# EAGLE design BMP280-Breakout_v10 (EAGLE 7.2.0)
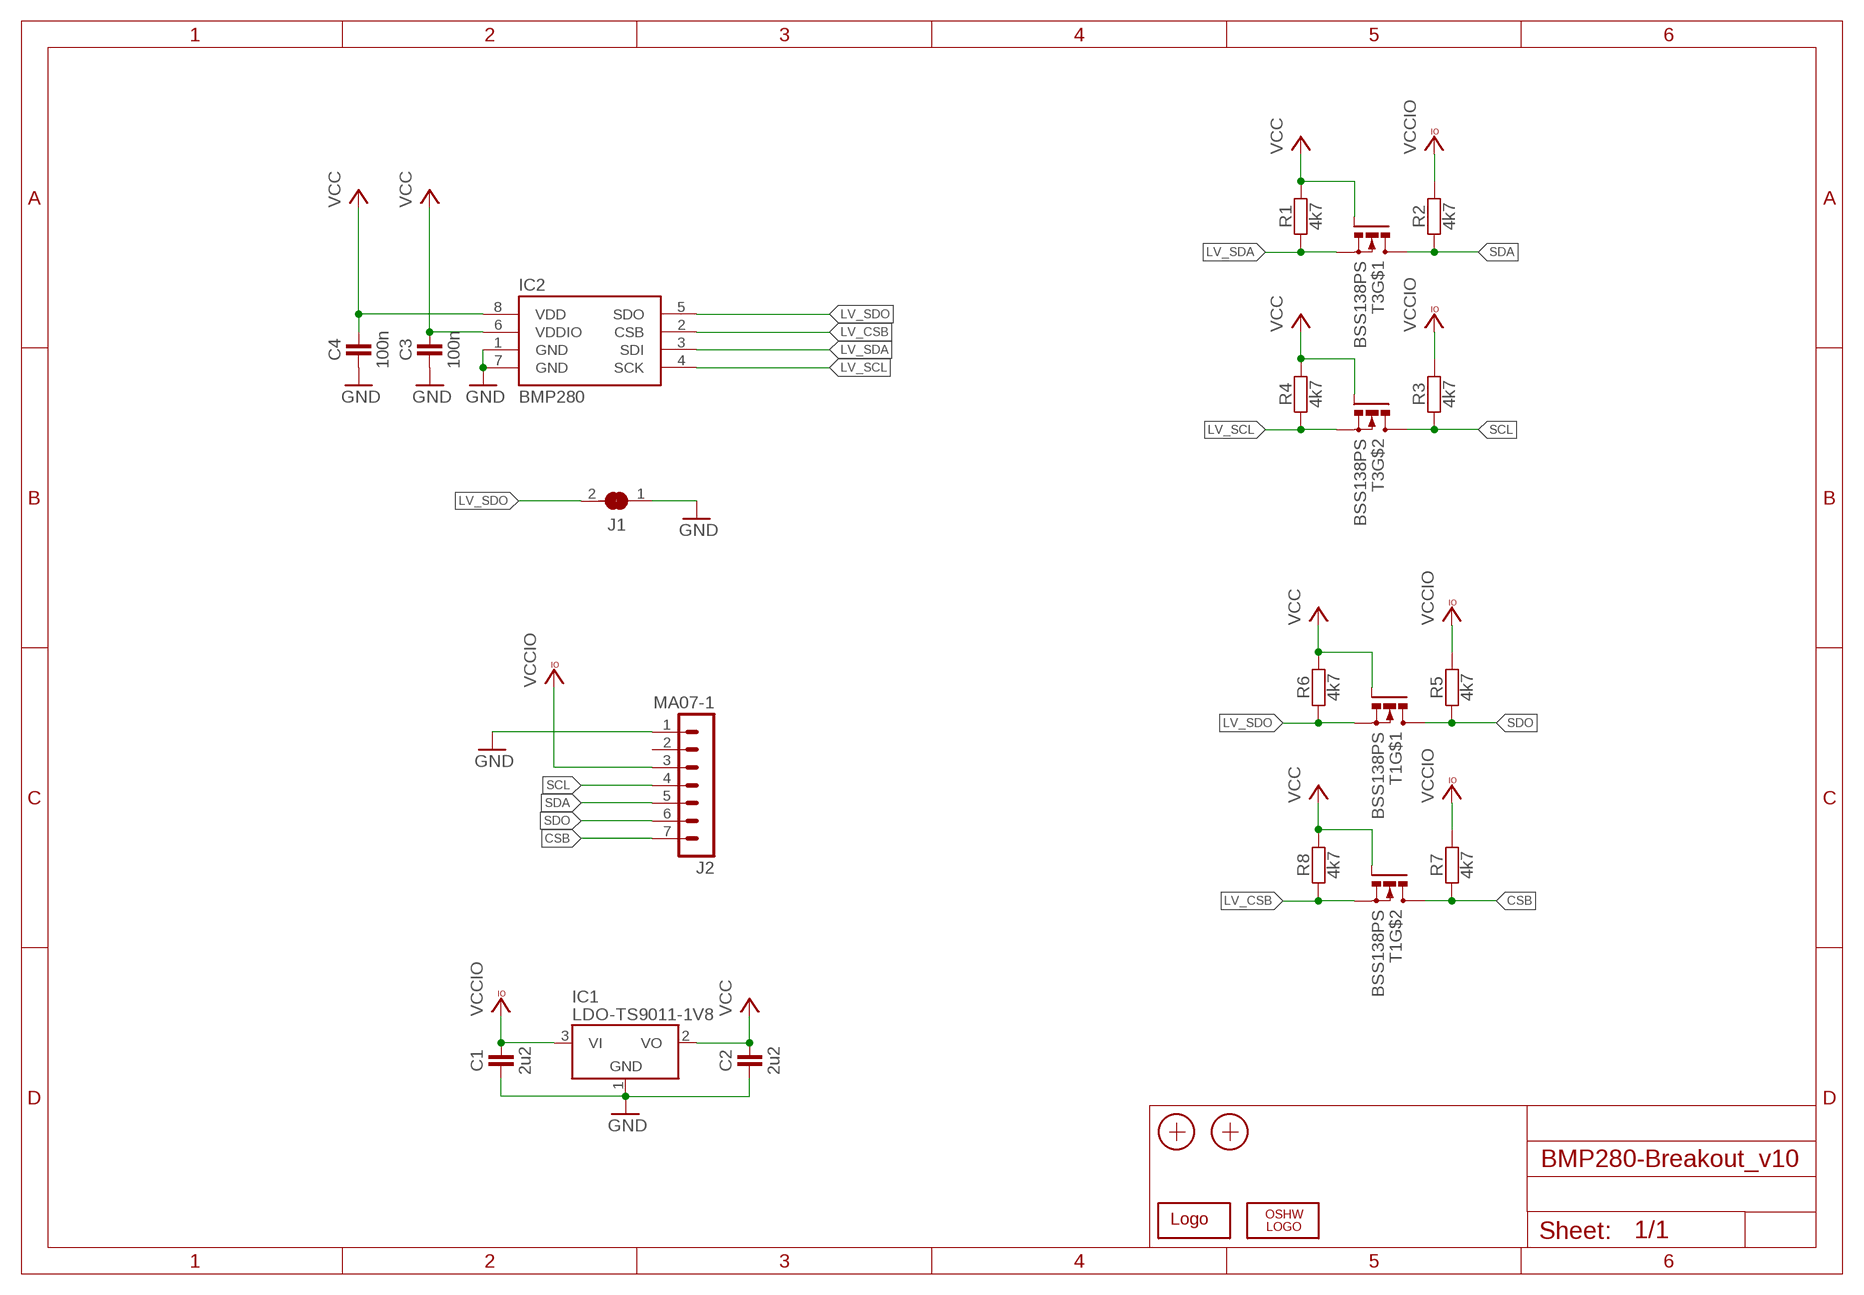
[diagram p0: schematic, sheet 1]

## Parts
C1  2u2  CAPACITOR-C0402  [R0402]
C2  2u2  CAPACITOR-C0402  [R0402]
C3  100n  CAPACITOR-C0402  [R0402]
C4  100n  CAPACITOR-C0402  [R0402]
IC1  LDO-TS9011-1V8  LDO-TS9011-3V3  [SOT23]
IC2  BMP280  [LGA]
J1  JUMPER2  [JUMPER2]
J2  MA07-1  [MA07-1]
LOGO1  LOGO-S_PLACE_M  [SPARK_TPLACE_M]
LOGO2  OSHW_LOGOX0070  [OSHW_6X70]
R1  4k7  RESISTOR-R0402  [R0402]
R2  4k7  RESISTOR-R0402  [R0402]
R3  4k7  RESISTOR-R0402  [R0402]
R4  4k7  RESISTOR-R0402  [R0402]
R5  4k7  RESISTOR-R0402  [R0402]
R6  4k7  RESISTOR-R0402  [R0402]
R7  4k7  RESISTOR-R0402  [R0402]
R8  4k7  RESISTOR-R0402  [R0402]
T1  BSS138PS  [SOT363]
T3  BSS138PS  [SOT363]
X1  PASSER-07  [PASSER_07MM]
X2  PASSER-07  [PASSER_07MM]

## Nets
CSB: J2.7 R7.1 T1.3(D)
GND: C1.1 C2.1 C3.1 C4.1 IC1.1(GND) IC2.1(GND) IC2.7(GND) J1.1 J2.1
LV_CSB: IC2.2(CSB) R8.1 T1.4(S)
LV_SCL: IC2.4(SCK) R4.1 T3.4(S)
LV_SDA: IC2.3(SDI) R1.1 T3.1(S)
LV_SDO: IC2.5(SDO) J1.2 R6.1 T1.1(S)
SCL: J2.4 R3.1 T3.3(D)
SDA: J2.5 R2.1 T3.6(D)
SDO: J2.6 R5.1 T1.6(D)
VCC: C2.2 C3.2 C4.2 IC1.2(VO) IC2.6(VDDIO) IC2.8(VDD) R1.2 R4.2 R6.2 R8.2 T1.2(G) T1.5(G) T3.2(G) T3.5(G)
VCCIO: C1.2 IC1.3(VI) J2.3 R2.2 R3.2 R5.2 R7.2
Unconnected: J2.2

## Library data of the parts
C1-C4 = we-rcl:CAPACITOR: Capacitors ...4.7uF @ 6.3V -> 0402 ...10uF @ 16V -> 0603 ...22uF @ 25V -> 0805
IC1 = we-power:LDO: LDOs TS1117 800mA, Vin max 12V TS9011 250mA, Vin max 12V - compatible AP2210 300mA, Vin max 15V TS5204 150mA, Vin max 16V
IC2 = we-sensor:BMP280: BOSCH BMP280 Digital Pressure Sensor
J1 = we-rcl:JUMPER2
J2 = we-con:MA07-1: PIN HEADER; OC_FARNELL: unknown; OC_NEWARK: unknown
LOGO1 = we-symbol:LOGO
LOGO2 = we-symbol:OSHW_LOGO
R1-R8 = we-rcl:RESISTOR: Resistors all kinds in 0603 and 0402
T1 T3 = we-transistor:BSS138PS
X1 X2 = we-symbol:PASSER

## Board
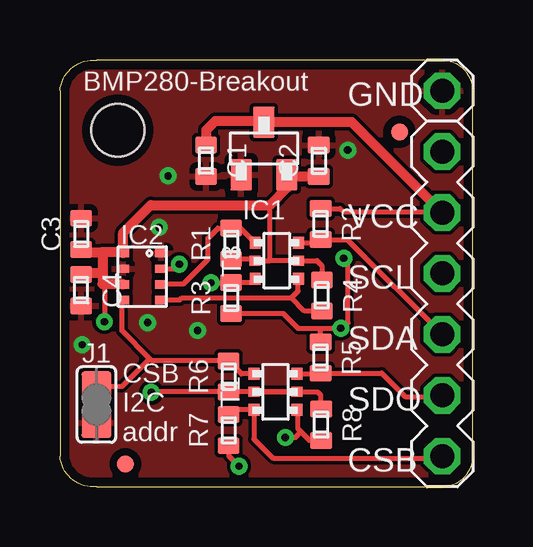
[diagram p1: board, top side]
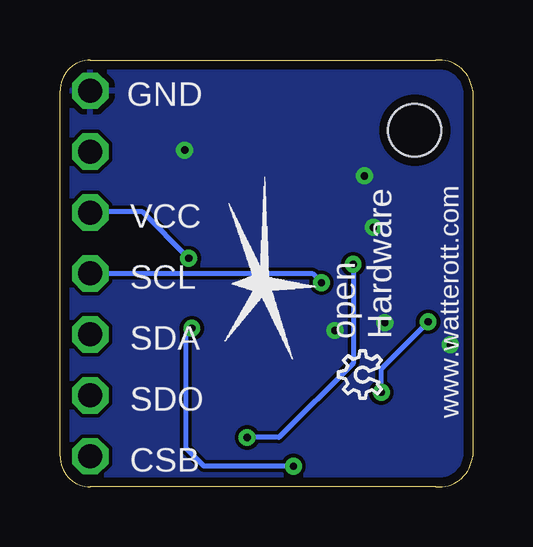
[diagram p2: board, bottom side, seen from below]

Size 17.21 x 17.79 mm. Coordinates in mm from the lower left corner, seen from the top.
Outline: 1.52,0.01 15.94,0.01 arc90 17.21,1.28 17.21,16.52 arc90 15.94,17.79 1.52,17.79 arc90 0,16.52 0,1.28 arc90 1.52,0.01
Copper layers (1*16): Top 0.035mm / dielectric 1.5mm / Bottom 0.035mm
Design rules "default *": minimum track width 6mil, minimum drill 0.296mm, track to track 6mil, track to pad 6mil, pad to pad 6mil, via to via 6mil, smd to smd 1mil, copper to edge 15mil, drill to drill 8mil, minimum pad ring 10mil, minimum via ring 8mil, stop-mask expansion 4mil, vias tented up to drill 0.7mm, thermal gap 10mil
Holes 2.2 mm at 2.41,14.86

### Footprints (pad centres in the part's own frame; a part is rotated, then mirrored left to right if it is on the bottom)
R0402 = smd 0.9 x 0.7: 1 0,0.65; 2 0,-0.65
SOT23 = smd 1.3 x 0.9: 1 -1.1,0.95; 2 -1.1,-0.95; 3 1.1,0
LGA = smd 0.5 x 0.35: 1 0.8,0.975; 2 0.8,0.325; 3 0.8,-0.325; 4 0.8,-0.975; 5 -0.8,-0.975; 6 -0.8,-0.325; 7 -0.8,0.325; 8 -0.8,0.975
JUMPER2 = smd 1.25 x 1.25: 1 0,0.76; 2 0,-0.76
MA07-1 = drill 1 octagon: 1 0,7.62; 2 0,5.08; 3 0,2.54; 4 0,0; 5 0,-2.54; 6 0,-5.08; 7 0,-7.62
SOT363 = smd 0.5 x 0.5: 1 -0.9,0.75; 3 -0.9,-0.75; 4 0.9,-0.75; 6 0.9,0.75 | smd 0.5 x 0.4: 2 -0.9,0; 5 0.9,0
PASSER_07MM = smd 0.7 x 0.7: X 0,0

### Placement (x,y rotation side)
C1  6.1,13.59 180 top
C2  10.79,13.59 0 top
C3  0.89,10.55 0 top
C4  0.89,8.2 180 top
IC1  8.51,14.1 90 top
IC2  3.43,8.77 0 top
J1  1.52,3.43 180 top
J2  15.94,8.9 0 top
LOGO1  8.76,8.51 90 bottom
LOGO2  3.81,3.69 90 bottom
R1  7.14,10.14 0 top
R2  10.87,10.95 180 top
R3  7.14,7.88 0 top
R4  10.92,7.98 180 top
R5  10.87,5.39 180 top
R6  7.04,4.6 0 top
R7  7.04,2.37 0 top
R8  10.9,2.6 180 top
T1  8.99,3.97 0 top
T3  9.04,9.43 0 top
X1  14.16,14.8 0 top
X2  2.73,0.96 0 top

### Tracks (layer width: path | path; a pad name or v marks a point on that pad's centre or on a via)
CSB
  Top 0.2: R7.1 7.24,3.22 T1.3 8.09,2 8.89,1.2 15.86,1.2 J2.7
GND  (via drill 0.3)
  other vias: 4.14,10.81 5.74,6.52 4.51,12.96 12,14.04 0.93,5.92 3.66,6.85
  pour Top: 0,17.79 17.21,17.79 17.21,0.01 0,0.01
  pour Bottom: 0,17.79 17.21,17.79 17.21,0.01 0,0.01
LV_CSB  (via drill 0.3)
  Top 0.2: R8.1 10.4,1.95 10.06,2.29 | 10.06,2.29 9.93,2.42 9.93,3.18 T1.4 | IC2.2 4.79,9.09 v4.98,9.28 | v9.4,2.06 9.83,2.06 10.06,2.29
  Bottom 0.2: v4.98,9.28 4.98,5.16 8.08,2.06 v9.4,2.06
LV_SCL
  Top 0.2: IC2.4 4.99,7.79 5.08,7.88 9.65,7.88 | 9.65,7.88 9.93,8.16 9.93,8.67 T3.4 | R4.1 10.2,7.33 9.65,7.88
LV_SDA
  Top 0.2: T3.1 7.53,10.79 R1.1 6.59,10.79 6.17,10.37 6.17,9.48 5.16,8.46 4.25,8.46 IC2.3
LV_SDO
  Top 0.2: 3.75,5.35 3.85,5.25 R6.1 7.57,4.72 T1.1 | 3.75,5.35 2.59,6.51 2.59,7.76 IC2.5 | J1.2 2.59,4.19 3.75,5.35
SCL  (via drill 0.3)
  Top 0.2: T3.3 7.99,8.53 R3.1 7.12,8.51 v6.3,8.51
  Bottom 0.2: J2.4 6.68,8.9 v6.3,8.51
SDA
  Top 0.2: T3.6 10.75,10.18 R2.1 11.99,10.3 J2.5
SDO
  Top 0.2: T1.6 10.85,4.72 R5.1 13.43,4.74 14.4,3.76 15.89,3.76 J2.6
VCC  (via drill 0.3)
  Top 0.2: 8.76,9.43 T3.5 10.72,9.43 10.92,9.23 R4.2 | 8.28,9.43 T3.2 8.08,9.49 | 9.52,12.94 9.52,12.5 | 8.08,9.49 R1.2 | 8.08,9.49 8.22,9.49 8.28,9.43 | 8.28,9.43 8.76,9.43 | 8.76,9.43 8.76,11.73 8.76,11.74 | R6.2 7.05,3.97 T1.2 T1.5 | T1.5 10.74,3.97 10.87,3.84 10.87,3.27 R8.2 | T1.5 3.83,3.97 v3.81,3.94 | v1.85,6.89 1.88,6.91 1.88,8.3 1.78,8.45
  Top 0.406: IC1.2 9.52,12.94 C2.2 | C3.2 1,9.78 1.78,9.78 | IC2.6 1.78,8.45 1.78,8.9 | 1.78,9.78 2.59,9.78 IC2.8 2.64,9.76 2.64,10.6 3.79,11.74 8.76,11.74 9.52,12.5 | 1.78,9.78 1.78,8.9 | 1.78,8.9 0.94,8.9 C4.2
  Bottom 0.2: v3.81,3.94 3.81,4.93 v1.85,6.89
VCCIO  (via drill 0.3)
  Top 0.2: R2.2 11.69,11.6 11.84,11.46 15.91,11.46 J2.3 | R3.2 9.31,7.23 9.93,6.61 10.95,6.61 | 10.95,6.61 v11.71,6.61 11.79,6.61 12.01,6.84 12.01,9.35 v11.84,9.53 | R5.2 10.87,6.53 10.95,6.61 | R7.2 7.04,1.3 v7.47,0.87
  Top 0.406: C1.2 6.1,14.86 6.48,15.25 8.47,15.25 IC1.3 12.17,15.2 J2.3
  Bottom 0.2: v11.84,9.53 13.77,11.46 15.32,11.46 15.34,11.44 J2.3 | v7.47,0.87 11.2,0.87 11.94,1.61 11.94,6.38 v11.71,6.61

### Text on the board
tPlace: BMP280-Breakout | GND | VCC | SCL | SDA | SDO | CSB / I2C / addr | CSB
bPlace: GND | www.watterott.com | VCC | SCL | open / Hardware | SDA | SDO | CSB